# EAGLE schematic camion-grue (EAGLE 8.6.0)
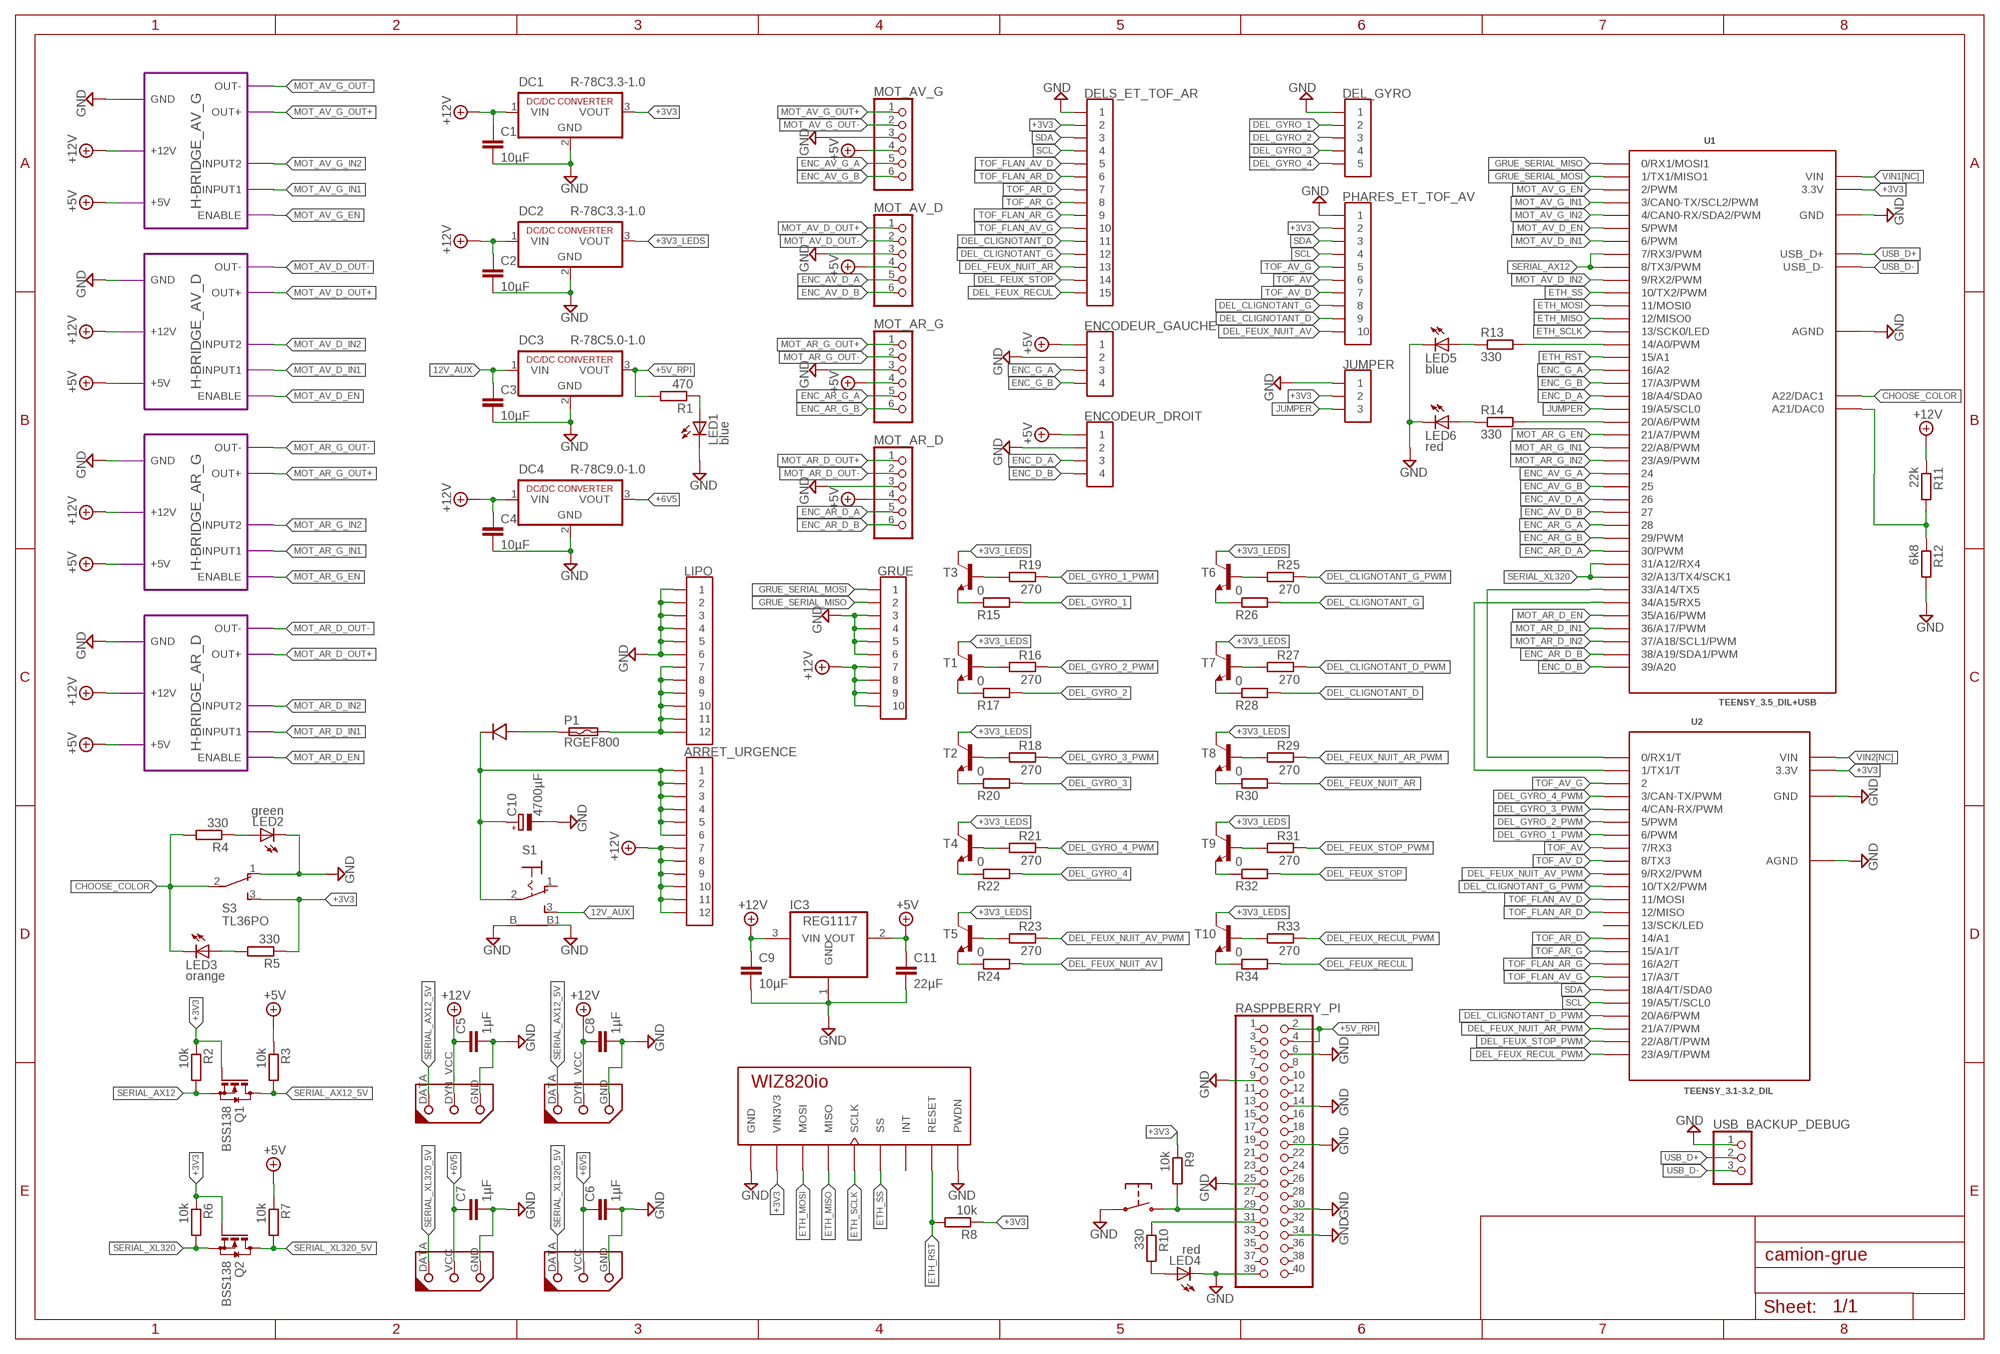
[diagram p0: schematic, sheet 1]

## Parts
ARRET_URGENCE  JST-12  [GH-12-V]
AX12_D  DYNAMIXEL-1X03AX  [DYNAMIXEL_AX_1X03]
AX12_G  DYNAMIXEL-1X03AX  [DYNAMIXEL_AX_1X03]
C1  10µF  C-EUC0805  [C0805]
C2  10µF  C-EUC0805  [C0805]
C3  10µF  C-EUC0805  [C0805]
C4  10µF  C-EUC0805  [C0805]
C5  1µF  C-EUC0805  [C0805]
C6  1µF  C-EUC0805  [C0805]
C7  1µF  C-EUC0805  [C0805]
C8  1µF  C-EUC0805  [C0805]
C9  10µF  C-EUC0805  [C0805]
C10  4700µF  CPOL-EUTT5D11L  [TT5D11L]
C11  22µF  C-EUC0805  [C0805]
D1  DIODE_S15P45  [TO-277A]
DC1  R-78C3.3-1.0  [SIP3]
DC2  R-78C3.3-1.0  [SIP3]
DC3  R-78C5.0-1.0  [SIP3]
DC4  R-78C9.0-1.0  [SIP3]
DEL_GYRO  JST-05  [GH-05-V]
DELS_ET_TOF_AR  JST-15  [GH-15-V]
ENCODEUR_DROIT  JST-04GH-V  [GH-04-V]
ENCODEUR_GAUCHE  JST-04GH-V  [GH-04-V]
GRUE  JST-10  [GH-10-V]
IC3  REG1117  [SOT223]
JUMPER  JST-03  [GH-03-V]
LED1  blue  LEDSMT1206  [1206]
LED2  green  LEDSMT1206  [1206]
LED3  orange  LEDSMT1206  [1206]
LED4  red  LEDSMT1206  [1206]
LED5  blue  LEDSMT1206  [1206]
LED6  red  LEDSMT1206  [1206]
LIPO  JST-12  [GH-12-V]
MOT_AR_D  PINHD-1X6  [1X06]
MOT_AR_G  PINHD-1X6  [1X06]
MOT_AV_D  PINHD-1X6  [1X06]
MOT_AV_G  PINHD-1X6  [1X06]
P1  RGEF800  [5MM]
PHARES_ET_TOF_AV  JST-10  [GH-10-V]
Q1  BSS138  BSS123  [SOT23]
Q2  BSS138  BSS123  [SOT23]
R1  470  R-EU_R0805  [R0805]
R2  10k  R-EU_R0805  [R0805]
R3  10k  R-EU_R0805  [R0805]
R4  330  R-EU_R0805  [R0805]
R5  330  R-EU_R0805  [R0805]
R6  10k  R-EU_R0805  [R0805]
R7  10k  R-EU_R0805  [R0805]
R8  10k  R-EU_R0805  [R0805]
R9  10k  R-EU_R0805  [R0805]
R10  330  R-EU_R0805  [R0805]
R11  22k  R-EU_R0805  [R0805]
R12  6k8  R-EU_R0805  [R0805]
R13  330  R-EU_R0805  [R0805]
R14  330  R-EU_R0805  [R0805]
R15  0  R-EU_R0805  [R0805]
R16  270  R-EU_R0805  [R0805]
R17  0  R-EU_R0805  [R0805]
R18  270  R-EU_R0805  [R0805]
R19  270  R-EU_R0805  [R0805]
R20  0  R-EU_R0805  [R0805]
R21  270  R-EU_R0805  [R0805]
R22  0  R-EU_R0805  [R0805]
R23  270  R-EU_R0805  [R0805]
R24  0  R-EU_R0805  [R0805]
R25  270  R-EU_R0805  [R0805]
R26  0  R-EU_R0805  [R0805]
R27  270  R-EU_R0805  [R0805]
R28  0  R-EU_R0805  [R0805]
R29  270  R-EU_R0805  [R0805]
R30  0  R-EU_R0805  [R0805]
R31  270  R-EU_R0805  [R0805]
R32  0  R-EU_R0805  [R0805]
R33  270  R-EU_R0805  [R0805]
R34  0  R-EU_R0805  [R0805]
RASPPBERRY_PI  PINHD-2X20/90  [2X20/90]
S1  SWITCH_LPV-1  [SWITCH_LPV-1]
S3  TL36PO  [TL3XPO]
T1  BC817-16-NPN-SOT23-BEC  [SOT23-BEC]
T2  BC817-16-NPN-SOT23-BEC  [SOT23-BEC]
T3  BC817-16-NPN-SOT23-BEC  [SOT23-BEC]
T4  BC817-16-NPN-SOT23-BEC  [SOT23-BEC]
T5  BC817-16-NPN-SOT23-BEC  [SOT23-BEC]
T6  BC817-16-NPN-SOT23-BEC  [SOT23-BEC]
T7  BC817-16-NPN-SOT23-BEC  [SOT23-BEC]
T8  BC817-16-NPN-SOT23-BEC  [SOT23-BEC]
T9  BC817-16-NPN-SOT23-BEC  [SOT23-BEC]
T10  BC817-16-NPN-SOT23-BEC  [SOT23-BEC]
U1  TEENSY_3.5_DIL+USB  [TEENSY_3.5_DIL+USB]
U2  TEENSY_3.1-3.2_DIL  [TEENSY_3.0-3.2&LC_DIL]
U$2  PUSH-BUTTON  [PUSH-BUTTON]
U$3  WIZ820IO  [WIZ820]
USB_BACKUP_DEBUG  PINHD-1X3  [1X03]
XL320_D  DYNAMIXEL-1X03XL  [DYNAMIXEL_XL_1X03]
XL320_G  DYNAMIXEL-1X03XL  [DYNAMIXEL_XL_1X03]

## Module instances
H-BRIDGE_AV_G = H-BRIDGE
H-BRIDGE_AV_D = H-BRIDGE
H-BRIDGE_AR_G = H-BRIDGE
H-BRIDGE_AR_D = H-BRIDGE

## Nets
12V_AUX: C3.1 DC3.1(VIN) S1.3(S)
+3V3: DC1.3(VOUT) DELS_ET_TOF_AR.2 JUMPER.2 PHARES_ET_TOF_AV.2 Q1.1(G) Q2.1(G) R2.1 R5.1 R6.1 R8.1 R9.1 S3.3(S) U1.3.3V U1.3.3V3(3.3V) U2.3.3V U$3.VIN1(VIN3V3) U$3.VIN2(VIN3V3)
+3V3_LEDS: DC2.3(VOUT) T1.C T2.C T3.C T4.C T5.C T6.C T7.C T8.C T9.C T10.C
+5V: C11.1 ENCODEUR_DROIT.1 ENCODEUR_GAUCHE.1 IC3.2(VOUT) MOT_AR_D.4 MOT_AR_G.4 MOT_AV_D.4 MOT_AV_G.4 R3.1 R7.1 ; port H-BRIDGE_AV_G.+5V H-BRIDGE_AV_D.+5V H-BRIDGE_AR_G.+5V H-BRIDGE_AR_D.+5V
+5V_RPI: DC3.3(VOUT) R1.2 RASPPBERRY_PI.2 RASPPBERRY_PI.4
+6V5: C6.1 C7.1 DC4.3(VOUT) XL320_D.VCC(DYN_VCC) XL320_G.VCC(DYN_VCC)
+12V: ARRET_URGENCE.7 ARRET_URGENCE.8 ARRET_URGENCE.9 ARRET_URGENCE.10 ARRET_URGENCE.11 ARRET_URGENCE.12 AX12_D.DYN_VCC AX12_G.DYN_VCC C1.1 C2.1 C4.1 C5.1 C8.1 C9.1 DC1.1(VIN) DC2.1(VIN) DC4.1(VIN) GRUE.7 GRUE.8 GRUE.9 GRUE.10 IC3.3(VIN) R11.1 ; port H-BRIDGE_AV_G.+12V H-BRIDGE_AV_D.+12V H-BRIDGE_AR_G.+12V H-BRIDGE_AR_D.+12V
CHOOSE_COLOR: LED3.C R4.2 S3.2(P) U1.A22(A22/DAC1)
DEL_CLIGNOTANT_D: DELS_ET_TOF_AR.11 PHARES_ET_TOF_AV.9 R28.2
DEL_CLIGNOTANT_D_PWM: R27.1 U2.20/A6(20/A6/PWM)
DEL_CLIGNOTANT_G: DELS_ET_TOF_AR.12 PHARES_ET_TOF_AV.8 R26.2
DEL_CLIGNOTANT_G_PWM: R25.1 U2.10(10/TX2/PWM)
DEL_FEUX_NUIT_AR: DELS_ET_TOF_AR.13 R30.2
DEL_FEUX_NUIT_AR_PWM: R29.1 U2.21/A7(21/A7/PWM)
DEL_FEUX_NUIT_AV: PHARES_ET_TOF_AV.10 R24.2
DEL_FEUX_NUIT_AV_PWM: R23.1 U2.9(9/RX2/PWM)
DEL_FEUX_RECUL: DELS_ET_TOF_AR.15 R34.2
DEL_FEUX_RECUL_PWM: R33.1 U2.23/A9(23/A9/T/PWM)
DEL_FEUX_STOP: DELS_ET_TOF_AR.14 R32.2
DEL_FEUX_STOP_PWM: R31.1 U2.22/A8(22/A8/T/PWM)
DEL_GYRO_1: DEL_GYRO.2 R15.2
DEL_GYRO_1_PWM: R19.1 U2.6(6/PWM)
DEL_GYRO_2: DEL_GYRO.3 R17.2
DEL_GYRO_2_PWM: R16.1 U2.5(5/PWM)
DEL_GYRO_3: DEL_GYRO.4 R20.2
DEL_GYRO_3_PWM: R18.1 U2.4(4/CAN-RX/PWM)
DEL_GYRO_4: DEL_GYRO.5 R22.2
DEL_GYRO_4_PWM: R21.1 U2.3(3/CAN-TX/PWM)
ENC_AR_D_A: MOT_AR_D.5 U1.30(30/PWM)
ENC_AR_D_B: MOT_AR_D.6 U1.38/A19(38/A19/SDA1/PWM)
ENC_AR_G_A: MOT_AR_G.5 U1.28
ENC_AR_G_B: MOT_AR_G.6 U1.29(29/PWM)
ENC_AV_D_A: MOT_AV_D.5 U1.26
ENC_AV_D_B: MOT_AV_D.6 U1.27
ENC_AV_G_A: MOT_AV_G.5 U1.24
ENC_AV_G_B: MOT_AV_G.6 U1.25
ENC_D_A: ENCODEUR_DROIT.3 U1.18/A4(18/A4/SDA0)
ENC_D_B: ENCODEUR_DROIT.4 U1.39/A20
ENC_G_A: ENCODEUR_GAUCHE.3 U1.16/A2
ENC_G_B: ENCODEUR_GAUCHE.4 U1.17/A3(17/A3/PWM)
ETH_MISO: U1.12(12/MISO0) U$3.MISO
ETH_MOSI: U1.11(11/MOSI0) U$3.MOSI
ETH_RST: R8.2 U1.15/A1 U$3.RESET
ETH_SCLK: U1.13(13/SCK0/LED) U$3.SCLK
ETH_SS: U1.10(10/TX2/PWM) U$3.SS
GND: AX12_D.GND AX12_G.GND C1.2 C2.2 C3.2 C4.2 C5.2 C6.2 C7.2 C8.2 C9.2 C10.- C11.2 DC1.2(GND) DC2.2(GND) DC3.2(GND) DC4.2(GND) DEL_GYRO.1 DELS_ET_TOF_AR.1 ENCODEUR_DROIT.2 ENCODEUR_GAUCHE.2 GRUE.3 GRUE.4 GRUE.5 GRUE.6 IC3.1(GND) JUMPER.1 LED1.C LED2.C LED4.C LED5.C LED6.C LIPO.1 LIPO.2 LIPO.3 LIPO.4 LIPO.5 LIPO.6 MOT_AR_D.3 MOT_AR_G.3 MOT_AV_D.3 MOT_AV_G.3 PHARES_ET_TOF_AV.1 R12.2 RASPPBERRY_PI.6 RASPPBERRY_PI.9 RASPPBERRY_PI.14 RASPPBERRY_PI.20 RASPPBERRY_PI.25 RASPPBERRY_PI.30 RASPPBERRY_PI.34 RASPPBERRY_PI.39 S1.B S1.B1 S3.1(O) U1.AGND U1.GND U1.GND1(GND) U2.AGND U2.GND U$2.1 U$2.2 U$3.GND1(GND) U$3.GND2(GND) U$3.GND3(GND) U$3.PWDN USB_BACKUP_DEBUG.1 XL320_D.GND XL320_G.GND ; port H-BRIDGE_AV_G.GND H-BRIDGE_AV_D.GND H-BRIDGE_AR_G.GND H-BRIDGE_AR_D.GND
GRUE_SERIAL_MISO: GRUE.2 U1.0(0/RX1/MOSI1)
GRUE_SERIAL_MOSI: GRUE.1 U1.1(1/TX1/MISO1)
JUMPER: JUMPER.3 U1.19/A5(19/A5/SCL0)
MOT_AR_D_EN: U1.35/A16(35/A16/PWM) ; port H-BRIDGE_AR_D.ENABLE
MOT_AR_D_IN1: U1.36/A17(36/A17/PWM) ; port H-BRIDGE_AR_D.INPUT1
MOT_AR_D_IN2: U1.37/A18(37/A18/SCL1/PWM) ; port H-BRIDGE_AR_D.INPUT2
MOT_AR_D_OUT+: MOT_AR_D.1 ; port H-BRIDGE_AR_D.OUT+
MOT_AR_D_OUT-: MOT_AR_D.2 ; port H-BRIDGE_AR_D.OUT-
MOT_AR_G_EN: U1.21/A7(21/A7/PWM) ; port H-BRIDGE_AR_G.ENABLE
MOT_AR_G_IN1: U1.22/A8(22/A8/PWM) ; port H-BRIDGE_AR_G.INPUT1
MOT_AR_G_IN2: U1.23/A9(23/A9/PWM) ; port H-BRIDGE_AR_G.INPUT2
MOT_AR_G_OUT+: MOT_AR_G.1 ; port H-BRIDGE_AR_G.OUT+
MOT_AR_G_OUT-: MOT_AR_G.2 ; port H-BRIDGE_AR_G.OUT-
MOT_AV_D_EN: U1.5(5/PWM) ; port H-BRIDGE_AV_D.ENABLE
MOT_AV_D_IN1: U1.6(6/PWM) ; port H-BRIDGE_AV_D.INPUT1
MOT_AV_D_IN2: U1.9(9/RX2/PWM) ; port H-BRIDGE_AV_D.INPUT2
MOT_AV_D_OUT+: MOT_AV_D.1 ; port H-BRIDGE_AV_D.OUT+
MOT_AV_D_OUT-: MOT_AV_D.2 ; port H-BRIDGE_AV_D.OUT-
MOT_AV_G_EN: U1.2(2/PWM) ; port H-BRIDGE_AV_G.ENABLE
MOT_AV_G_IN1: U1.3(3/CAN0-TX/SCL2/PWM) ; port H-BRIDGE_AV_G.INPUT1
MOT_AV_G_IN2: U1.4(4/CAN0-RX/SDA2/PWM) ; port H-BRIDGE_AV_G.INPUT2
MOT_AV_G_OUT+: MOT_AV_G.1 ; port H-BRIDGE_AV_G.OUT+
MOT_AV_G_OUT-: MOT_AV_G.2 ; port H-BRIDGE_AV_G.OUT-
N$1: LED1.A R1.1
N$2: R9.2 RASPPBERRY_PI.29 U$2.3 U$2.4
N$3: ARRET_URGENCE.1 ARRET_URGENCE.2 ARRET_URGENCE.3 ARRET_URGENCE.4 ARRET_URGENCE.5 ARRET_URGENCE.6 C10.+ D1.- S1.2(P)
N$4: D1.+1(+) D1.+2(+) P1.P$1
N$5: R10.1 RASPPBERRY_PI.31
N$6: U1.33/A14(33/A14/TX5) U2.0(0/RX1/T)
N$7: LED2.A R4.1
N$8: LED3.A R5.2
N$9: LIPO.7 LIPO.8 LIPO.9 LIPO.10 LIPO.11 LIPO.12 P1.P$2
N$10: U1.34/A15(34/A15/RX5) U2.1(1/TX1/T)
N$11: LED4.A R10.2
N$12: R11.2 R12.1 U1.A21(A21/DAC0)
N$13: LED6.A R14.1
N$14: LED5.A R13.1
N$15: R13.2 U1.14/A0(14/A0/PWM)
N$16: R14.2 U1.20/A6(20/A6/PWM)
N$17: R15.1 T3.E
N$18: R19.2 T3.B
N$21: R17.1 T1.E
N$22: R16.2 T1.B
N$25: R20.1 T2.E
N$26: R18.2 T2.B
N$29: R22.1 T4.E
N$30: R21.2 T4.B
N$33: R24.1 T5.E
N$34: R23.2 T5.B
N$37: R26.1 T6.E
N$38: R25.2 T6.B
N$41: R28.1 T7.E
N$42: R27.2 T7.B
N$45: R30.1 T8.E
N$46: R29.2 T8.B
N$49: R32.1 T9.E
N$50: R31.2 T9.B
N$53: R34.1 T10.E
N$54: R33.2 T10.B
SCL: DELS_ET_TOF_AR.4 PHARES_ET_TOF_AV.4 U2.19/A5(19/A5/T/SCL0)
SDA: DELS_ET_TOF_AR.3 PHARES_ET_TOF_AV.3 U2.18/A4(18/A4/T/SDA0)
SERIAL_AX12: Q1.2(S) R2.2 U1.7(7/RX3/PWM) U1.8(8/TX3/PWM)
SERIAL_AX12_5V: AX12_D.DATA AX12_G.DATA Q1.3(D) R3.2
SERIAL_XL320: Q2.2(S) R6.2 U1.31/A12(31/A12/RX4) U1.32/A13(32/A13/TX4/SCK1)
SERIAL_XL320_5V: Q2.3(D) R7.2 XL320_D.DATA XL320_G.DATA
TOF_AR_D: DELS_ET_TOF_AR.7 U2.14/A0(14/A1)
TOF_AR_G: DELS_ET_TOF_AR.8 U2.15/A1(15/A1/T)
TOF_AV: PHARES_ET_TOF_AV.6 U2.7(7/RX3)
TOF_AV_D: PHARES_ET_TOF_AV.7 U2.8(8/TX3)
TOF_AV_G: PHARES_ET_TOF_AV.5 U2.2
TOF_FLAN_AR_D: DELS_ET_TOF_AR.6 U2.12(12/MISO)
TOF_FLAN_AR_G: DELS_ET_TOF_AR.9 U2.16/A2(16/A2/T)
TOF_FLAN_AV_D: DELS_ET_TOF_AR.5 U2.11(11/MOSI)
TOF_FLAN_AV_G: DELS_ET_TOF_AR.10 U2.17/A3(17/A3/T)
USB_D+: U1.USBD+(USB_D+) USB_BACKUP_DEBUG.2
USB_D-: U1.USBD-(USB_D-) USB_BACKUP_DEBUG.3
VIN1[NC]: U1.VIN
VIN2[NC]: U2.VIN
Unconnected: RASPPBERRY_PI.1 RASPPBERRY_PI.3 RASPPBERRY_PI.5 RASPPBERRY_PI.7 RASPPBERRY_PI.8 RASPPBERRY_PI.10 RASPPBERRY_PI.11 RASPPBERRY_PI.12 RASPPBERRY_PI.13 RASPPBERRY_PI.15 RASPPBERRY_PI.16 RASPPBERRY_PI.17 RASPPBERRY_PI.18 RASPPBERRY_PI.19 RASPPBERRY_PI.21 RASPPBERRY_PI.22 RASPPBERRY_PI.23 RASPPBERRY_PI.24 RASPPBERRY_PI.26 RASPPBERRY_PI.27 RASPPBERRY_PI.28 RASPPBERRY_PI.32 RASPPBERRY_PI.33 RASPPBERRY_PI.35 RASPPBERRY_PI.36 RASPPBERRY_PI.37 RASPPBERRY_PI.38 RASPPBERRY_PI.40 S1.1(O) U2.13(13/SCK/LED) U$3.INT

## Library data of the parts
ARRET_URGENCE LIPO = con-jst:JST-12
AX12_D AX12_G = 1NTech_pinhead:DYNAMIXEL-1X03; RS_AX: 687-8124; RS_XL: 688-3283
C1-C9 C11 = resistor:C-EU: CAPACITOR, European symbol
C10 = 1NTech_RLCD:CPOL-EU: POLARIZED CAPACITOR, European symbol
D1 = diode_schottky:DIODE_S15P45
DC1-DC4 = dc-dc-converter:R-78C*-1.0: INNOLINE DC/DC-Converter 1.0 AMP SIP3 Single Output Source: Data sheet <http://www.mikrocontroller.net/attachment/150645/157764-da-01-en-DC_DC_WANDLER_R_78C5_0_1_0.pdf>
DEL_GYRO = con-jst:JST-05
DELS_ET_TOF_AR = con-jst:JST-15
ENCODEUR_DROIT ENCODEUR_GAUCHE = con-jst:JST-04
GRUE PHARES_ET_TOF_AV = con-jst:JST-10
IC3 = burr-brown:REG1117: 800mA and 1A Low Dropout (LDO) Positive Regulator 1.8V, 2.5V, 2.85V, 3.3V, 5V, and Adj; MPN: REG1117; OC_FARNELL: 1097566; OC_NEWARK: 14P6981; RS: 885-5432
JUMPER = con-jst:JST-03
LED1-LED6 = led:LED: LED OSRAM: - CHIPLED LG R971, LG N971, LY N971, LG Q971, LY Q971, LO R971, LY R971 LH N974, LH R974 LS Q976, LO Q976, LY Q976 LO Q996 - Hyper CHIPLED LW Q18S LB Q993, LB Q99A, LB R99A - SideLED LS A670, LO A670, LY A670, LG A670, LP A670 LB A673, LV A673, LT A673, LW A673 LH A674 LY A675 LS A676, LA A676, LO A676, LY A676, LW A676 LS A679, LY A679, LG A679 - Hyper Micro SIDELED® LS Y876, LA Y876, LO Y876, LY Y876 LT Y87S - SmartLED LW L88C, LW L88S LB L89C, LB L89S, LG L890 LS L89K, LO L89K, LY L89K LS L896, LA L896, LO L896, LY L896 - TOPLED LS T670, LO T670, LY T670, LG T670, LP T670 LSG T670, LSP T670, LSY T670, LOP T670, LYG T670 LG T671, LOG T671, LSG T671 LB T673, LV T673, LT T673, LW T673 LH T674 LS T676, LA T676, LO T676, LY T676, LB T676, LH T676, LSB T676, LW T676 LB T67C, LV T67C, LT T67C, LS T67K, LO T67K, LY T67K, LW E67C LS E67B, LA E67B, LO E67B, LY E67B, LB E67C, LV E67C, LT E67C LW T67C LS T679, LY T679, LG T679 LS T770, LO T770, LY T770, LG T770, LP T770 LB T773, LV T773, LT T773, LW T773 LH T774 LS E675, LA E675, LY E675, LS T675 LS T776, LA T776, LO T776, LY T776, LB T776 LHGB T686 LT T68C, LB T68C - Hyper Mini TOPLED® LB M676 - Mini TOPLED Santana® LG M470 LS M47K, LO M47K, LY M47K Source: http://www.osram.convergy.de LUXEON: - LUMILED® LXK2-PW12-R00, LXK2-PW12-S00, LXK2-PW14-U00, LXK2-PW14-V00 LXK2-PM12-R00, LXK2-PM12-S00, LXK2-PM14-U00 LXK2-PE12-Q00, LXK2-PE12-R00, LXK2-PE12-S00, LXK2-PE14-T00, LXK2-PE14-U00 LXK2-PB12-K00, LXK2-PB12-L00, LXK2-PB12-M00, LXK2-PB14-N00, LXK2-PB14-P00, LXK2-PB14-Q00 LXK2-PR12-L00, LXK2-PR12-M00, LXK2-PR14-Q00, LXK2-PR14-R00 LXK2-PD12-Q00, LXK2-PD12-R00, LXK2-PD12-S00 LXK2-PH12-R00, LXK2-PH12-S00 LXK2-PL12-P00, LXK2-PL12-Q00, LXK2-PL12-R00 Source: www.luxeon.com KINGBRIGHT: KA-3528ASYC Source: www.kingbright.com
MOT_AR_D MOT_AR_G MOT_AV_D MOT_AV_G = pinhead:PINHD-1X6: PIN HEADER
P1 = polyswitch:RGEF800; RS: 517-6966
Q1 Q2 = transistor-small-signal:BSS123: N-CHANNEL MOS FET
R1-R34 = resistor:R-EU_: RESISTOR, European symbol
RASPPBERRY_PI = pinhead:PINHD-2X20: PIN HEADER
S1 = switch:SWITCH_LPV-1: TOGGLE SWITCH; RS: 734-7306
S3 = switch:TL36PO: TINY SWITCH ON - ON Source: http://www2.produktinfo.conrad.com/datenblaetter/700000-724999/705152-da-01-de-Subminiaturschalter_TL_36YO.pdf
T1 T3 = transistor:*-NPN-: NPN Transistror BF959 corrected 2008.03.06; RS: 781-4272
T2 T4-T10 = transistor:*-NPN-: NPN Transistror BF959 corrected 2008.03.06
U1 = Teensy_libSG:TEENSY_3.5_DIL+USB
U2 = Teensy_libSG:TEENSY_3.1-3.2_DIL: Teensy 3.1 or 3.2 in a DIL Layout.
U$2 = push-button:PUSH-BUTTON; RS: 479-1491
U$3 = WIZnet:WIZ820IO
USB_BACKUP_DEBUG = pinhead:PINHD-1X3: PIN HEADER
XL320_D XL320_G = 1NTech_pinhead:DYNAMIXEL-1X03

## Module H-BRIDGE
Ports: +5V(pwr) +12V(pwr) GND(pwr) ENABLE(io) INPUT1(io) INPUT2(io) OUT-(io) OUT+(io)
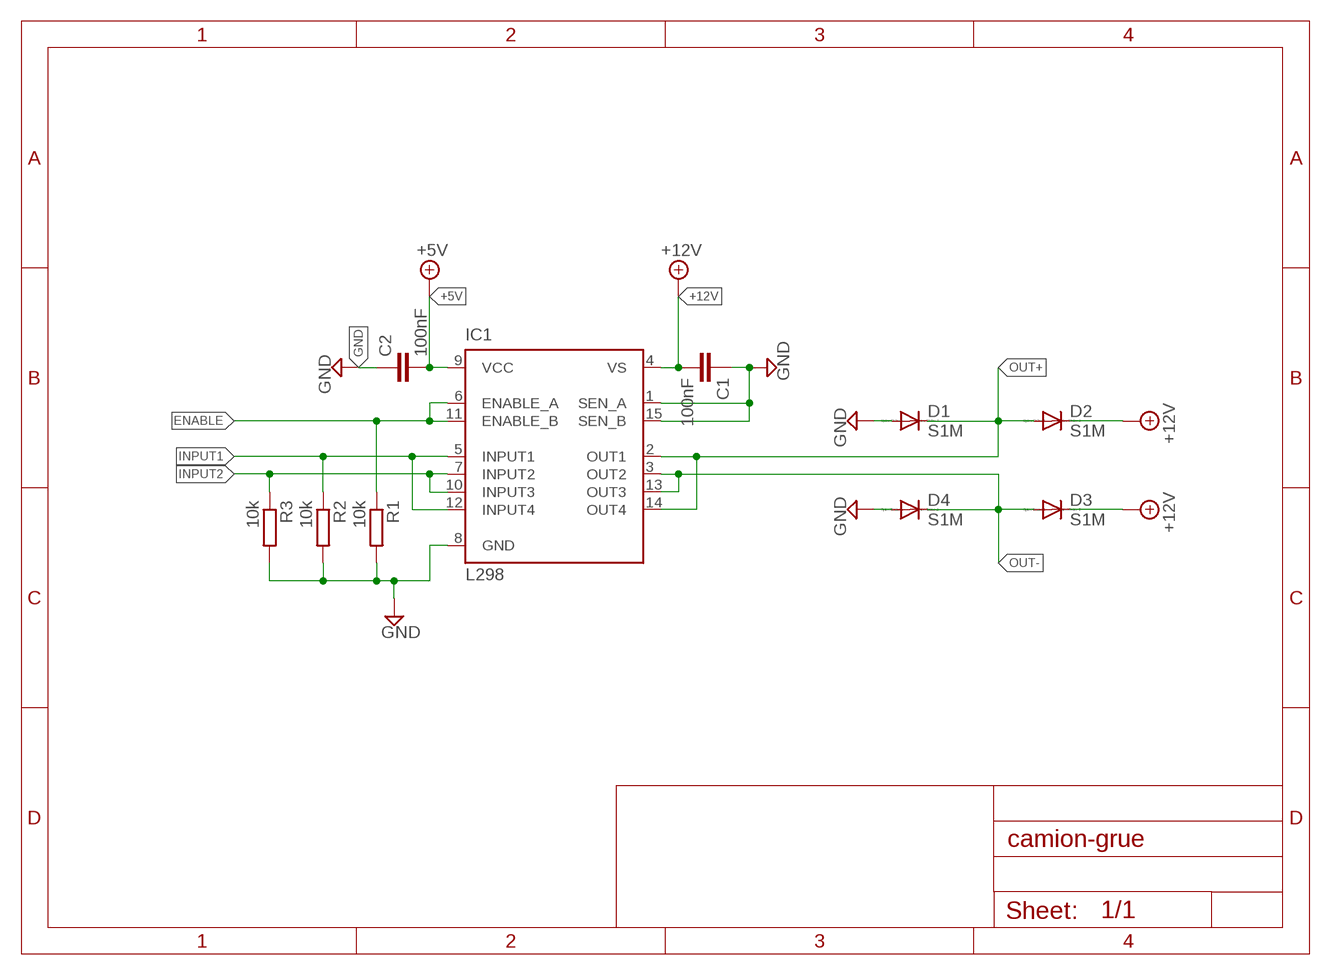
[diagram p1: schematic, module H-BRIDGE, sheet 1]

### Parts
C1  100nF  C-EUC0805  [C0805]
C2  100nF  C-EUC0805  [C0805]
D1  S1M  [SMA]
D2  S1M  [SMA]
D3  S1M  [SMA]
D4  S1M  [SMA]
IC1  L298  [MULTIWATT-15]
R1  10k  R-EU_R0805  [R0805]
R2  10k  R-EU_R0805  [R0805]
R3  10k  R-EU_R0805  [R0805]

### Nets
+5V: C2.2 IC1.9(VCC)
+12V: C1.2 D2.C D3.C IC1.4(VS)
ENABLE: IC1.6(ENABLE_A) IC1.11(ENABLE_B) R1.1
GND: C1.1 C2.1 D1.A D4.A IC1.1(SEN_A) IC1.8(GND) IC1.15(SEN_B) R1.2 R2.2 R3.2
INPUT1: IC1.5(INPUT1) IC1.12(INPUT4) R2.1
INPUT2: IC1.7(INPUT2) IC1.10(INPUT3) R3.1
OUT+: D1.C D2.A IC1.2(OUT1) IC1.14(OUT4)
OUT-: D3.A D4.C IC1.3(OUT2) IC1.13(OUT3)

### Library data of the parts
C1 C2 = resistor:C-EU: CAPACITOR, European symbol
D1-D4 = diode:S1M; RS: 872-2874
IC1 = st-microelectronics:L298: DUAL FULL-BRIDGE DRIVER; MPN: L298N; OC_FARNELL: 1589425; OC_NEWARK: 32M1527
R1-R3 = resistor:R-EU_: RESISTOR, European symbol